# Altium project fish.PrjPCB
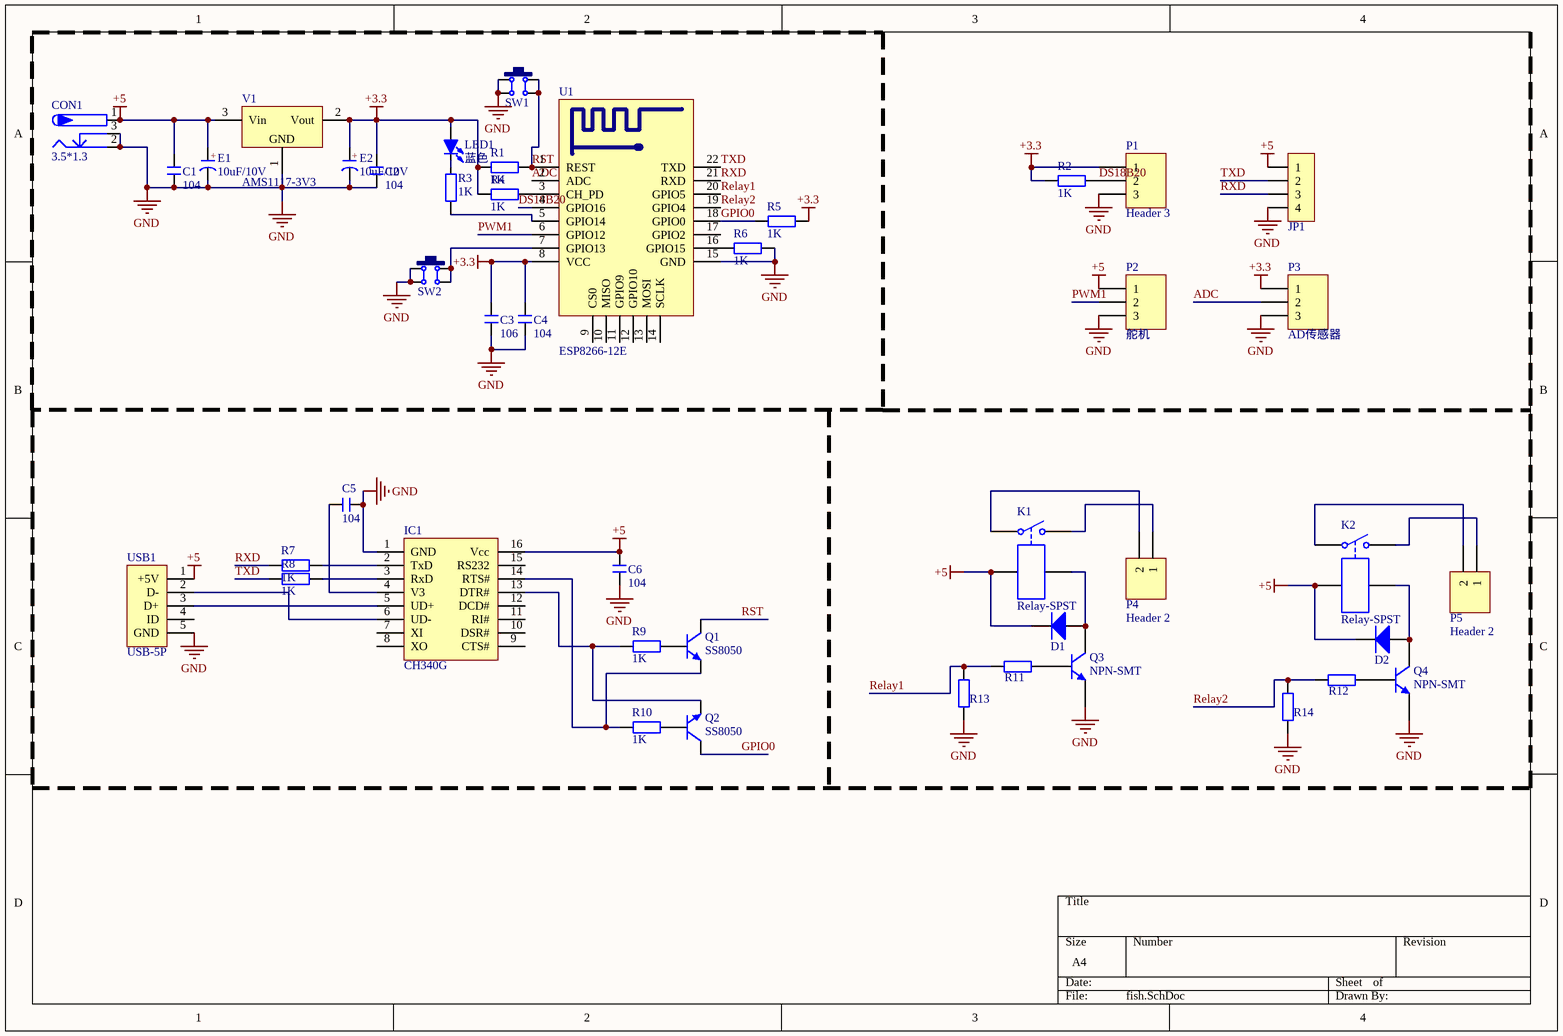
[diagram p0: fish.SchDoc]
1 sheet, 44 parts. Net scope: global (net labels, ports and power ports of the same name join across sheets).
Board file: fish.PcbDoc

## Sheet fish.SchDoc
size A4

### Parts
C1  104  [C 0603]
C2  104  [C 0603]
C3  106  [C 0603]
C4  104  [C 0603]
C5  104  [C 0603]
C6  104  [C 0603]
CON1  3.5*1.3  [DC-005]
D1  Diode  Glass  [DSO-C2/X2.3]  (value not drawn)
D2  Diode  Glass  [DSO-C2/X2.3]  (value not drawn)
E1  10uF/10V  [CM D(6.3*5.4)]
E2  10uF/10V  [CM D(6.3*5.4)]
IC1  CH340G  [SOP16_L]
JP1  HDR-1X4  [XH2.54-4P]  (value not drawn)
K1  Relay-SPST  [RELAY_HF46F]
K2  Relay-SPST  [RELAY_HF46F]
LED1  蓝色  [LED 3MM-B]
P1  Header 3  [HX2.54-3]
P2  舵机  [HX2.54-3]
P3  AD传感器  [HX2.54-3]
P4  Header 2  [HX5.08-2L]
P5  Header 2  [HX5.08-2L]
Q1  SS8050  [SOT23-3N]
Q2  SS8050  [SOT23-3N]
Q3  NPN-SMT  [SOT-23]
Q4  NPN-SMT  [SOT-23]
R1  1K  [R 0603]
R2  1K  [R 0603]
R3  1K  [R 0603]
R4  1K  [R 0603]
R5  1K  [R 0603]
R6  1K  [R 0603]
R7  1K  [R 0603]
R8  1K  [R 0603]
R9  1K  [R 0603]
R10  1K  [R 0603]
R11  Resistor Chip  [RES_0603]  (value not drawn)
R12  Resistor Chip  [RES_0603]  (value not drawn)
R13  Resistor Chip  [RES_0603]  (value not drawn)
R14  Resistor Chip  [RES_0603]  (value not drawn)
SW1  6x6x5  [TSW SMD-6*6*4.3]  (value not drawn)
SW2  6x6x5  [TSW SMD-6*6*4.3]  (value not drawn)
U1  ESP8266-12E  [ESP_12E]
USB1  USB-5P  [USB-MICRO_D]
V1  AMS1117-3V3  [SOT223_L]

### Nets
+3.3: C2.2 C3.2 C4.2 E2.1(A) LED1.1(A) P1.1 P3.1 R1.1 R2.1 R4.1 R5.2 U1.8(VCC) V1.2(Vout)
+5: C1.2 C6.2 CON1.1 D1.2(K) D2.2(K) E1.1(A) IC1.16(Vcc) JP1.1 K1.3 K2.3 P2.1 USB1.1(+5V) V1.3(Vin)
GND: C1.1 C2.1 C3.1 C4.1 C5.2 C6.1 CON1.2 CON1.3 E1.2(K) E2.2(K) IC1.1(GND) JP1.4 P1.3 P2.3 P3.3 Q3.2(E) Q4.2(E) R6.2 R13.1 R14.1 SW1.1 SW1.4 SW2.1 SW2.4 U1.15(GND) USB1.5(GND) V1.1(GND)
ADC: P3.2 U1.2(ADC)
DS18B20: P1.2 R2.2 U1.4(GPIO16)
GPIO0: Q2.3(C) R5.1 U1.18(GPIO0)
PWM1: P2.2 U1.6(GPIO12)
Relay1: R11.2 R13.2 U1.20(GPIO5)
Relay2: R12.2 R14.2 U1.19(GPIO4)
RST: Q1.3(C) R1.2 SW1.2 SW1.3 U1.1(REST)
RXD: JP1.3 R7.1 U1.21(RXD)
TXD: JP1.2 R8.1 U1.22(TXD)
NetC5_1: C5.1 IC1.4(V3)
NetD1_1: D1.1(A) K1.4 Q3.3(C)
NetD2_1: D2.1(A) K2.4 Q4.3(C)
NetIC1_2: IC1.2(TxD) R7.2
NetIC1_3: IC1.3(RxD) R8.2
NetIC1_5: IC1.5(UD+) USB1.3(D+)
NetIC1_6: IC1.6(UD-) USB1.2(D-)
NetIC1_13: IC1.13(DTR#) Q2.2(E) R9.1
NetIC1_14: IC1.14(RTS#) Q1.2(E) R10.1
NetK1_1: K1.1 P4.2
NetK1_2: K1.2 P4.1
NetK2_1: K2.1 P5.2
NetK2_2: K2.2 P5.1
NetLED1_2: LED1.2(K) R3.2
NetQ1_1: Q1.1(B) R9.2
NetQ2_1: Q2.1(B) R10.2
NetQ3_1: Q3.1(B) R11.1
NetQ4_1: Q4.1(B) R12.1
NetR3_1: R3.1 U1.5(GPIO14)
NetR4_2: R4.2 U1.3(CH_PD)
NetR6_1: R6.1 U1.16(GPIO15)
NetSW2_2: SW2.2 SW2.3 U1.7(GPIO13)

Not connected (* = marked no-connect by the designer): IC1 7(XI) 8(XO) 9(CTS#) 10(DSR#) 11(RI#) 12(DCD#) 15(RS232); U1 9(CS0) 10(MISO) 11(GPIO9) 12(GPIO10) 13(MOSI) 14(SCLK) 17(GPIO2); USB1 4(ID)

### Notes on the sheet
- (in symbol C-CM) +

### Library data of the parts
C1-C6 = C: 无极性贴片电容; 版权归属: 黎明电子style; BOM名称: 无极性贴片电容; 学习资源: https://lmdzstyle.taobao.com/
CON1 = P-DC: 低压电源接口; BOM名称: DC电源接口; 版权归属: 黎明电子style; 学习资源: https://lmdzstyle.taobao.com/
D1 D2 = Diode  Glass: High Conductance Fast Diode; Revision 1: 11-Jul-2000: SIM Model Added.; Revision 2: 17-Jul-2002: Re-released for DXP Platform.; Code - JEDEC: DO-204-AH; Model: IN4148; Published: 8-Jun-2000; Datasheet: Latest Revision: 1997; Package Reference: DO-35; Publisher: Altium Limited
E1 E2 = C-CM: 贴片电解电容; 版权归属: 黎明电子style; BOM名称: 贴片电解电容; 学习资源: https://lmdzstyle.taobao.com/
IC1 = CH340G: 串口转USB; 版权归属: 黎明电子style; BOM名称: 串口转USB; 学习资源: https://lmdzstyle.taobao.com/
JP1 = Header 4: 4P接插件; 版权归属: 黎明电子style; BOM名称: 4P接插件; 学习资源: https://lmdzstyle.taobao.com/
K1 K2 = Relay-SPST: Single-Pole Single-Throw Relay; Published: 24-Mar-1999; Revision: July-2002: Re-released for DXP Platform.; Publisher: Altium Limited
LED1 = LED-3MM: 插件LED; 版权归属: 黎明电子style; BOM名称: 插件LED; 学习资源: https://lmdzstyle.taobao.com/
P1-P3 = Header 3: Header, 3-Pin; LatestRevisionDate: 17-Jul-2002; LatestRevisionNote: Re-released for DXP Platform.; Publisher: Altium Limited
P4 P5 = Header 2: Header, 2-Pin; LatestRevisionDate: 17-Jul-2002; LatestRevisionNote: Re-released for DXP Platform.; Publisher: Altium Limited
Q1 Q2 = 8050-SMD: 高频放大-NPN型; 版权归属: 黎明电子style; 属性: 40V 1.5A 1W 100MHZ; BOM名称: 高频放大-NPN型; 学习资源: https://lmdzstyle.taobao.com/
Q3 Q4 = NPN-SMT: NPN Bipolar Transistor; Code - JEDEC: TO-226-AA; Published: 8-Jun-2000; Revision: July-2002: Re-released for DXP Platform.; Publisher: Altium Limited
R1-R10 = R: 贴片电阻; 版权归属: 黎明电子style; BOM名称: 贴片电阻; 学习资源: https://lmdzstyle.taobao.com/
R11-R14 = Resistor Chip: Resistor; Published: 8-Jun-2000; Revision: July-2002: Re-released for DXP Platform.; Publisher: Altium Limited
SW1 SW2 = TSW SMD-6x6: 贴片6x6轻触开关; 版权归属: 黎明电子style; BOM名称: 贴片6x6轻触开关; 学习资源: https://lmdzstyle.taobao.com/
U1 = ESP8266-12E: 串口 WIFI模块，ESP-12E; BOM名称: WIFI模块; 版权归属: 黎明电子style; 学习资源: https://lmdzstyle.taobao.com/
USB1 = USB-5P: 微型USB母座; 版权归属: 黎明电子style; BOM名称: 微型USB母座; 学习资源: https://lmdzstyle.taobao.com/
V1 = AMS1117: 三端稳压芯片; BOM名称: 稳压芯片; 版权归属: 黎明电子style; 学习资源: https://lmdzstyle.taobao.com/